# Altium schematic sheet RPI_drawing.schdoc
size 274 x 130 mm
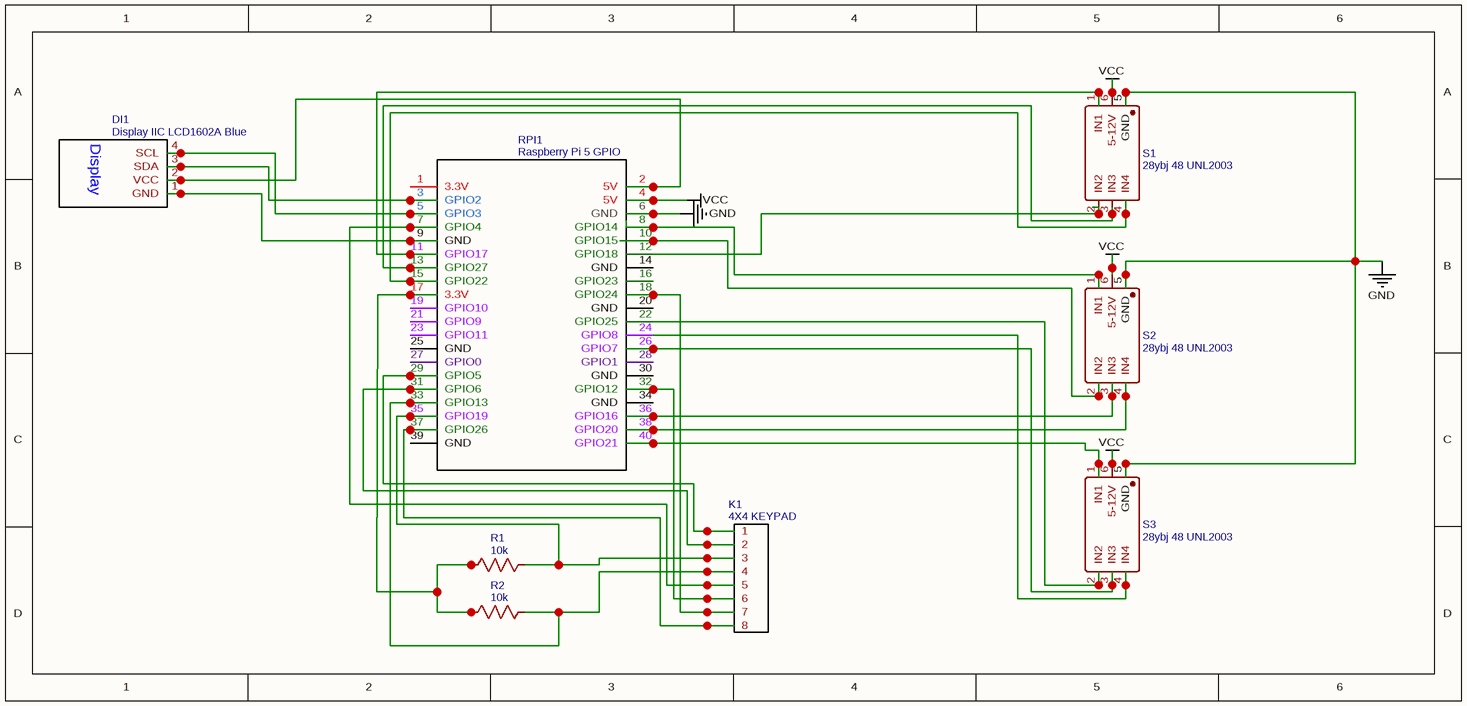
[diagram p0: RPI_drawing.schdoc]

## Parts
DI1  Display IIC LCD1602A Blue  [DISPLAY IIC LCD1602A BLUE]
K1  4X4 KEYPAD  [KEYPAD 4X4 (KEYPAD 4*4)]
R1  10k  [R0603]
R2  10k  [R0603]
RPI1  Raspberry Pi 5 GPIO  [HDR-20X2/2.54]
S1  28ybj 48 UNL2003  [28YBJ 48 UNL2003]
S2  28ybj 48 UNL2003  [28YBJ 48 UNL2003]
S3  28ybj 48 UNL2003  [28YBJ 48 UNL2003]

## Nets
GND: RPI1.6(GND) S1.5(GND) S2.5(GND) S3.5(GND)
VCC: RPI1.4(5V) S1.6(5-12V) S2.6(5-12V) S3.6(5-12V)
NetDI1_1: DI1.1(GND) RPI1.9(GND)
NetDI1_2: DI1.2(VCC) RPI1.2(5V)
NetDI1_3: DI1.3(SDA) RPI1.3(GPIO2)
NetDI1_4: DI1.4(SCL) RPI1.5(GPIO3)
NetK1_3: K1.3(1) RPI1.29(GPIO5)
NetK1_4: K1.4(2) RPI1.31(GPIO6)
NetK1_5: K1.5(3) R1.2 RPI1.35(GPIO19)
NetK1_6: K1.6(4) R2.2 RPI1.33(GPIO13)
NetK1_7: K1.7(5) RPI1.7(GPIO4)
NetK1_8: K1.8(6) RPI1.32(GPIO12)
NetK1_9: K1.9(7) RPI1.18(GPIO24)
NetK1_10: K1.10(8) RPI1.37(GPIO26)
NetR1_1: R1.1 R2.1 RPI1.17(3.3V)
NetRPI1_8: RPI1.8(GPIO14) S2.1(IN1)
NetRPI1_10: RPI1.10(GPIO15) S2.2(IN2)
NetRPI1_11: RPI1.11(GPIO17) S1.1(IN1)
NetRPI1_12: RPI1.12(GPIO18) S1.2(IN2)
NetRPI1_13: RPI1.13(GPIO27) S1.3(IN3)
NetRPI1_15: RPI1.15(GPIO22) S1.4(IN4)
NetRPI1_22: RPI1.22(GPIO25) S3.2(IN2)
NetRPI1_24: RPI1.24(GPIO8) S3.4(IN4)
NetRPI1_26: RPI1.26(GPIO7) S3.3(IN3)
NetRPI1_36: RPI1.36(GPIO16) S2.3(IN3)
NetRPI1_38: RPI1.38(GPIO20) S2.4(IN4)
NetRPI1_40: RPI1.40(GPIO21) S3.1(IN1)

Not connected (* = marked no-connect by the designer): RPI1 1(3.3V) 14(GND) 16(GPIO23) 19(GPIO10) 20(GND) 21(GPIO9) 23(GPIO11) 25(GND) 27(GPIO0) 28(GPIO1) 30(GND) 34(GND) 39(GND)

## Notes on the sheet
- (in symbol Display IIC LCD1602A Blue) Display

## Library data of the parts
DI1 = Display IIC LCD1602A Blue: Contributor: ziclope; spicePre: D; spiceSymbolName: Display IIC LCD1602A Blue
K1 = 4X4 KEYPAD: Contributor: hasbifajrul03; spicePre: U; spiceSymbolName: 4X4 KEYPAD SIMPLE
R1 R2 = 10k: nameAlias: Value(Ω); Contributor: LCEDA_Lib; spicePre: R; spiceSymbolName: R_0603_US
RPI1 = Raspberry Pi 5 GPIO: Manufacturer: Raspberry Pi 5 4GB; Contributor: marcus06second; spicePre: R; spiceSymbolName: Raspberry Pi 5
S1-S3 = 28ybj 48 UNL2003: Contributor: amenard; spicePre: U; spiceSymbolName: 28ybj 48 UNL2003